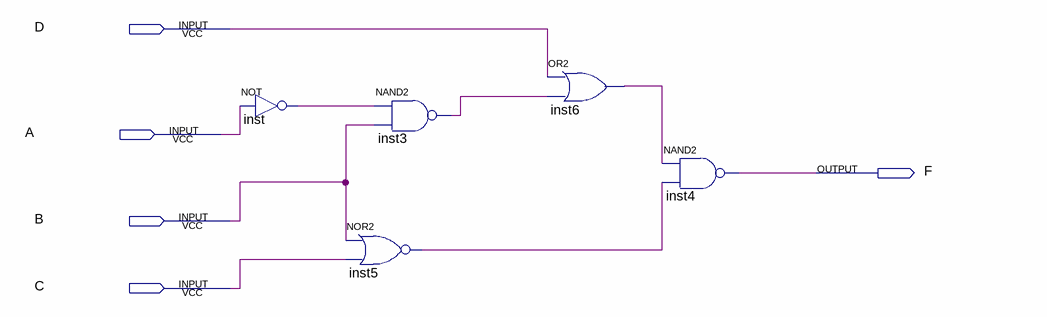
[diagram p0: schematic sheet]
// Quartus schematic lab3.bdf as structural Verilog: 5 symbols, 5 pins
module lab3 (
  input  D,
  input  A,
  input  B,
  input  C,
  output F
);

  wire inst3_out, inst5_out, inst6_out, inst_out;

  not inst (inst_out, A);
  nand inst3 (inst3_out, inst_out, B);
  nor inst5 (inst5_out, B, C);
  or inst6 (inst6_out, D, inst3_out);
  nand inst4 (F, inst6_out, inst5_out);
endmodule
